# Altium schematic sheet 24V.SchDoc
size A3; SheetNumber: 22; SheetTotal: 29; SPICEModelCacheIVOQGUXW: <root> / <DocumentId>IVOQGUXW</DocumentId> / </root>
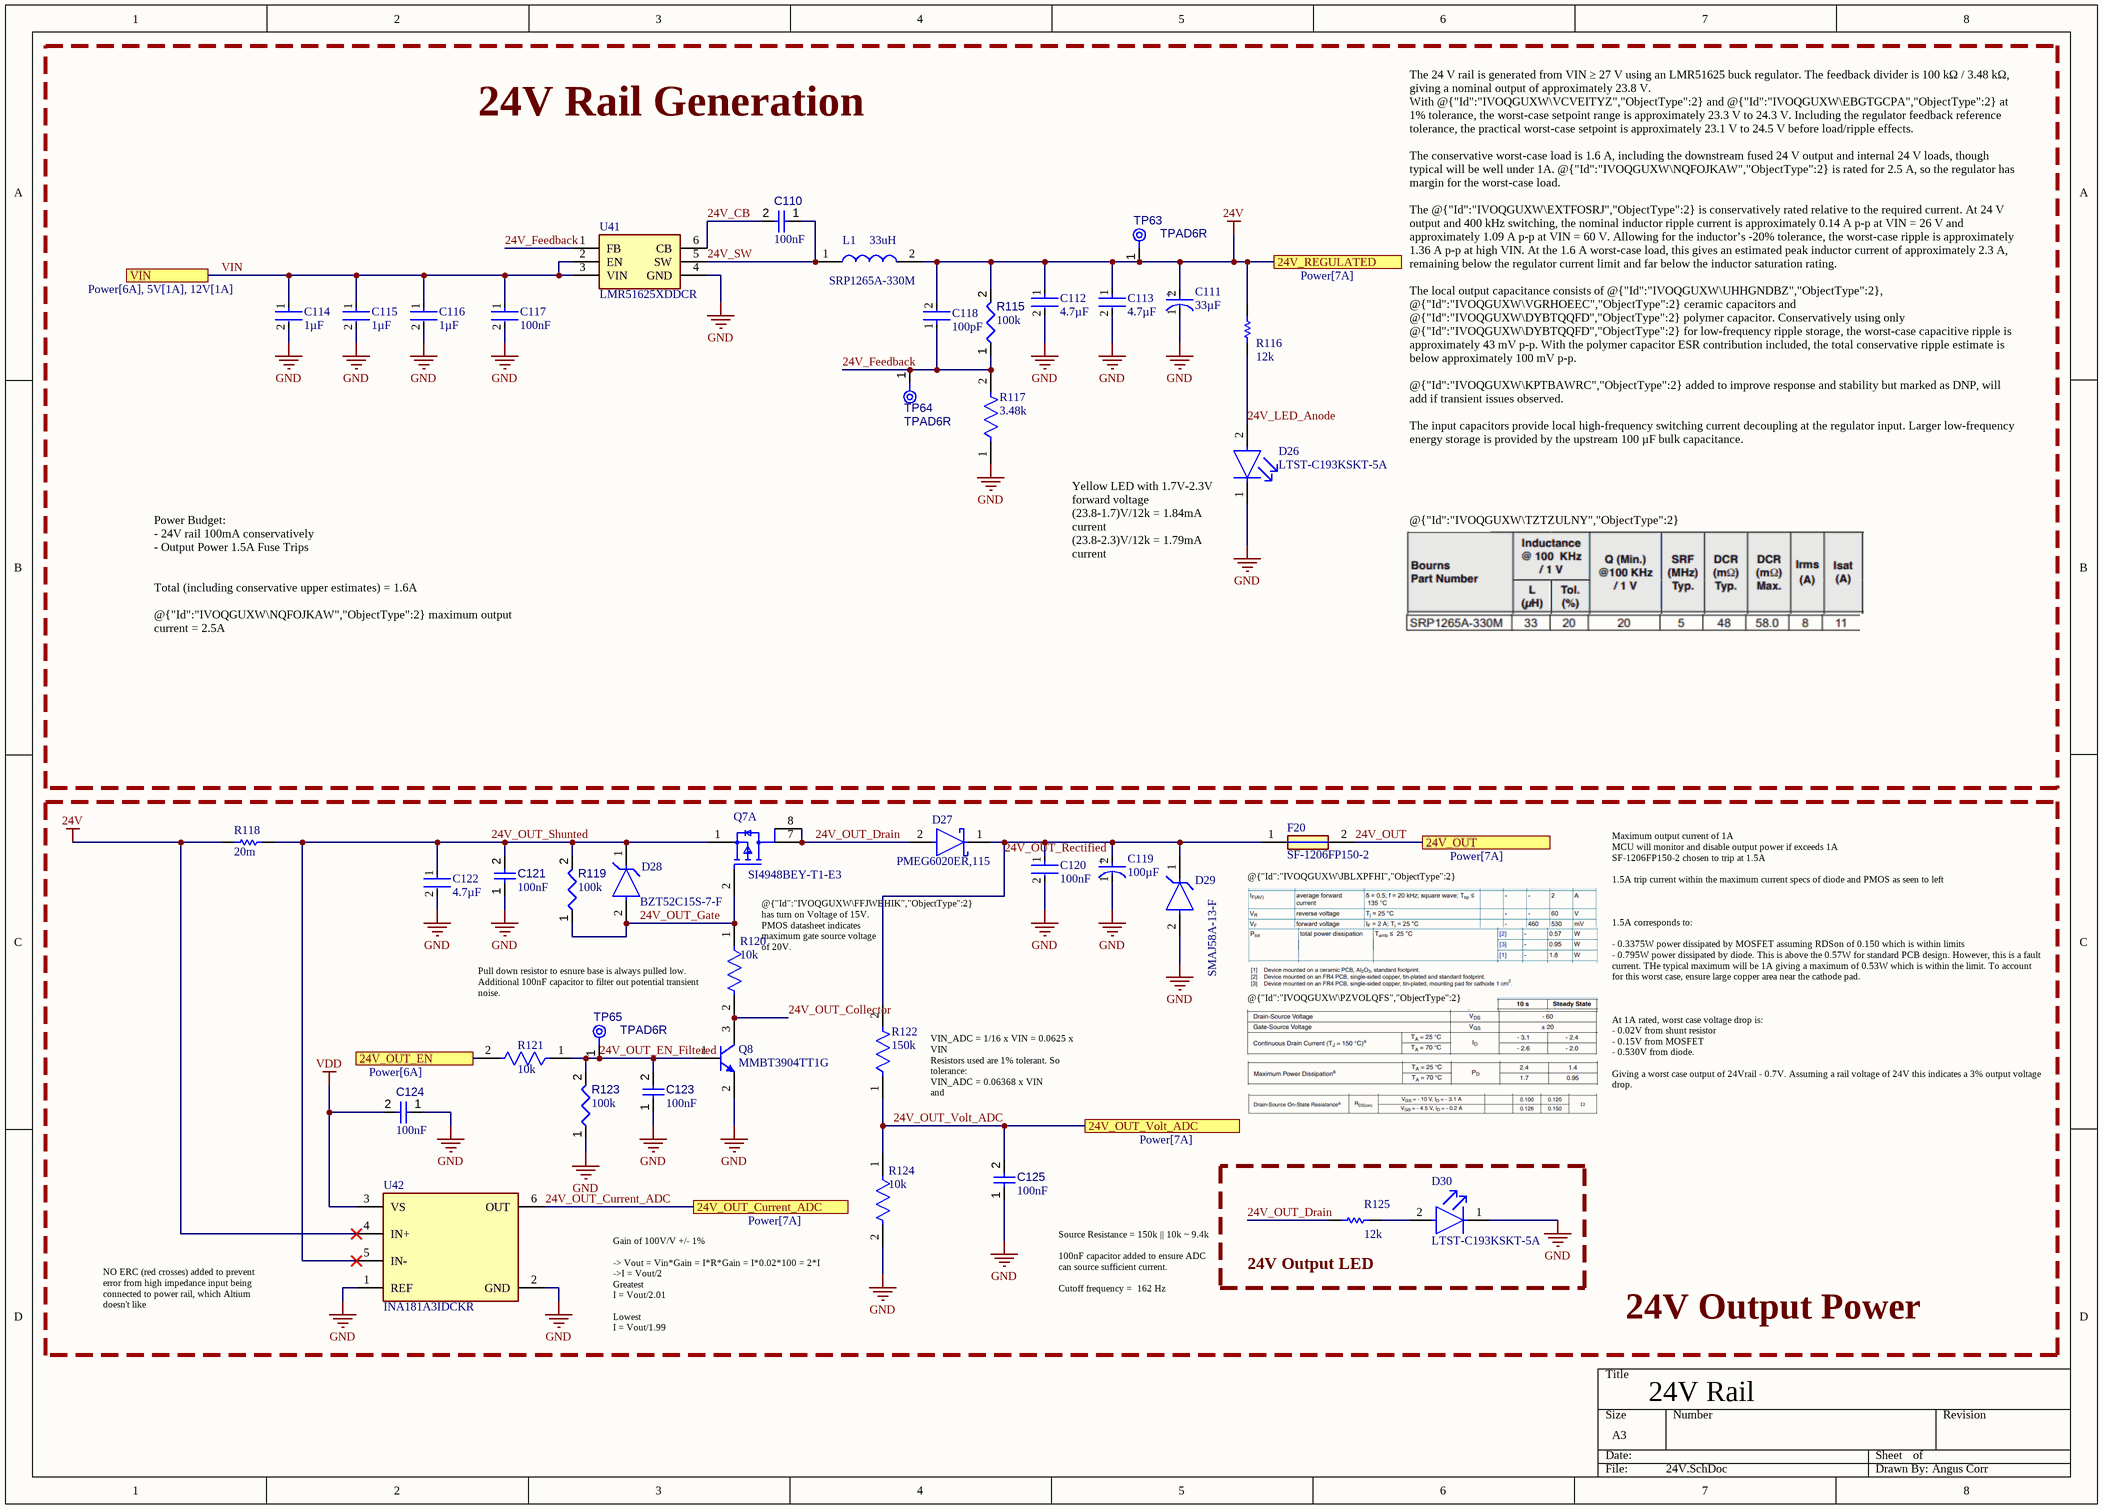
[diagram p0: 24V.SchDoc]

## Parts
C110  value 100nF  [CAPC1608X90X40NL10T20]  (hidden comment: Capacitor 100 nF +/-10% 50 V 0603)
C111  value 33µF  [FP-EEH-D8-MFG]  (hidden comment: EEHZA1H330XP)
C112  value 4.7µF  [FP-GRM21B-0_2-e0_2_0_7-MFG]  (hidden comment: GRM21BZ71H475KE15L)
C113  value 4.7µF  [FP-GRM21B-0_2-e0_2_0_7-MFG]  (hidden comment: GRM21BZ71H475KE15L)
C114  value 1µF  [FP-GRJ21B-0_35-MFG]  (hidden comment: GRJ21BC72A105KE11L)
C115  value 1µF  [FP-GRJ21B-0_35-MFG]  (hidden comment: GRJ21BC72A105KE11L)
C116  value 1µF  [FP-GRJ21B-0_35-MFG]  (hidden comment: GRJ21BC72A105KE11L)
C117  value 100nF  [FP-GRM31C-0_2-e0_3_0_8-IPC_C]  (hidden comment: GRM31C5C2A104JA01L)
C118  value 100pF  [FP-C0603C-CF-IPC_B]  (hidden comment: C0603C101F5GACTU)
C119  value 100µF  [FP-MVYAKE0-MFG]  (hidden comment: EMVY101ARA101MKE0S)
C120  value 100nF  [FP-GRM31C-0_2-e0_3_0_8-IPC_C]  (hidden comment: GRM31C5C2A104JA01L)
C121  value 100nF  [CAPC1608X90X40NL10T20]  (hidden comment: Capacitor 100 nF +/-10% 50 V 0603)
C122  value 4.7µF  [FP-GRM21B-0_2-e0_2_0_7-MFG]  (hidden comment: GRM21BZ71H475KE15L)
C123  value 100nF  [CAPC1608X90X40NL10T20]  (hidden comment: Capacitor 100 nF +/-10% 50 V 0603)
C124  value 100nF  [CAPC1608X90X40NL10T20]  (hidden comment: Capacitor 100 nF +/-10% 50 V 0603)
C125  value 100nF  [CAPC1608X90X40NL10T20]  (hidden comment: Capacitor 100 nF +/-10% 50 V 0603)
D26  LTST-C193KSKT-5A  [FP-LTST-C193KGKT-5A-MFG]
D27  PMEG6020ER,115  [FP-SOD123W-MFG]
D28  BZT52C15S-7-F  [FP-SOD323-IPC_A]
D29  SMAJ58A-13-F  [FP-SMA-MFG]
D30  LTST-C193KSKT-5A  [FP-LTST-C193KGKT-5A-MFG]
F20  SF-1206FP150-2  [FUSC3116X70N]
L1  SRP1265A-330M  [SRP1265A]
Q7  SI4948BEY-T1-E3  [FP-C-06527-IPC_B]  (part A of 2)
Q8  MMBT3904TT1G  [ONSC-SC-75-3-463-01_V]
R115  value 100k  [FP-AC0603-IPC_C]  (hidden comment: AC0603FR-07100KL)
R116  value 12k  [RESC1608X55X25LL10T15]  (hidden comment: RC0603FR-0712KL)
R117  value 3.48k  [FP-AC0603-IPC_C]  (hidden comment: AC0603FR-073K48L)
R118  value 20m  [RESC3216X89X51NL25T25]  (hidden comment: WSL1206R0200FEA)
R119  value 100k  [FP-AC0603-IPC_C]  (hidden comment: AC0603FR-07100KL)
R120  value 10k  [FP-RT0603-IPC_C]  (hidden comment: RT0603BRD0710KL)
R121  value 10k  [FP-RT0603-IPC_C]  (hidden comment: RT0603BRD0710KL)
R122  value 150k  [FP-CRGCQ0603-IPC_A]  (hidden comment: CRGCQ0603F150K)
R123  value 100k  [FP-AC0603-IPC_C]  (hidden comment: AC0603FR-07100KL)
R124  value 10k  [FP-RT0603-IPC_C]  (hidden comment: RT0603BRD0710KL)
R125  value 12k  [RESC1608X55X25LL10T15]  (hidden comment: RC0603FR-0712KL)
TP63  TPAD6R  [TP06R]  (no BOM)
TP64  TPAD6R  [TP06R]  (no BOM)
TP65  TPAD6R  [TP06R]  (no BOM)
U41  LMR51625XDDCR  [SOT95P280X110-6N]
U42  INA181A3IDCKR  [FP-DCK0006A-IPC_A]

## Blocks framed on the sheet
24V Rail Generation: C110-C118 D26 L1 R115-R117 TP63 TP64 U41
24V Output Power: C119-C125 D27-D29 F20 Q7 Q8 R118-R124 TP65 U42
24V Output LED: D30 R125

## Ports
24V_OUT (see Power[7A]), 24V_OUT_Current_ADC (see Power[7A]), 24V_OUT_EN (see Power[6A]), 24V_OUT_Volt_ADC (see Power[7A]), 24V_REGULATED (see Power[7A]), VIN (see Power[6A], 5V[1A], 12V[1A])

## Nets
24V: C111.2(A) C112.1 C113.1 C118.2 L1.2 R115.2 R116.1 R118.1 TP63.1(TP) U42.4(IN+) ; port 24V_REGULATED
GND: C111.1(C) C112.2 C113.2 C114.2 C115.2 C116.2 C117.2 C119.1(C) C120.2 C121.1 C122.2 C123.1 C124.1 C125.1 D26.1(C) D29.2(A) D30.1(C) Q8.2(E) R117.1 R123.1 R124.2 U41.4(GND) U42.1(REF) U42.2(GND)
VDD: C124.2 U42.3(VS)
24V_CB: C110.2 U41.6(CB)
24V_Feedback: C118.1 R115.1 R117.2 TP64.1(TP) U41.1(FB)
24V_LED_Anode: D26.2(A) R116.2
24V_OUT: F20.2 ; port 24V_OUT
24V_OUT_Collector: Q8.3(C) R120.2
24V_OUT_Current_ADC: U42.6(OUT) ; port 24V_OUT_Current_ADC
24V_OUT_Drain: D27.2(A) Q7.7(D1) Q7.8(D1) R125.1
24V_OUT_EN: R121.2 ; port 24V_OUT_EN
24V_OUT_EN_Filtered: C123.2 Q8.1(B) R121.1 R123.2 TP65.1(TP)
24V_OUT_Gate: D28.2(A) Q7.2(G1) R119.1 R120.1
24V_OUT_Rectified: C119.2(A) C120.1 D27.1(C) D29.1(C) F20.1 R122.2
24V_OUT_Shunted: C121.2 C122.1 D28.1(C) Q7.1(S1) R118.2 R119.2 U42.5(IN-)
24V_OUT_Volt_ADC: C125.2 R122.1 R124.1 ; port 24V_OUT_Volt_ADC
24V_SW: C110.1 L1.1 U41.5(SW)
VIN: C114.1 C115.1 C116.1 C117.1 U41.2(EN) U41.3(VIN) ; port VIN
NetD30_2: D30.2(A) R125.2

## Notes on the sheet
- (near L1) 33uH
- The 24 V rail is generated from VIN ≥ 27 V using an LMR51625 buck regulator. The feedback divider is 100 kΩ / 3.48 kΩ, giving a nominal output of approximately 23.8 V.
  With @{"Id":"IVOQGUXW\VCVEITYZ","ObjectType":2} and @{"Id":"IVOQGUXW\EBGTGCPA","ObjectType":2} at 1% tolerance, the worst-case setpoint range is approximately 23.3 V to 24.3 V. Including the regulator feedback reference tolerance, the practical worst-case setpoint is approximately 23.1 V to 24.5 V before load/ripple effects.
  The conservative worst-case load is 1.6 A, including the downstream fused 24 V output and internal 24 V loads, though typical will be well under 1A. @{"Id":"IVOQGUXW\NQFOJKAW","ObjectType":2} is rated for 2.5 A, so the regulator has margin for the worst-case load.
  The @{"Id":"IVOQGUXW\EXTFOSRJ","ObjectType":2} is conservatively rated relative to the required current. At 24 V output and 400 kHz switching, the nominal inductor ripple current is approximately 0.14 A p-p at VIN = 26 V and approximately 1.09 A p-p at VIN = 60 V. Allowing for the inductor’s -20% tolerance, the worst-case ripple is approximately 1.36 A p-p at high VIN. At the 1.6 A worst-case load, this gives an estimated peak inductor current of approximately 2.3 A, remaining below the regulator current limit and far below the inductor saturation rating.
  The local output capacitance consists of @{"Id":"IVOQGUXW\UHHGNDBZ","ObjectType":2}, @{"Id":"IVOQGUXW\VGRHOEEC","ObjectType":2} ceramic capacitors and @{"Id":"IVOQGUXW\DYBTQQFD","ObjectType":2} polymer capacitor. Conservatively using only @{"Id":"IVOQGUXW\DYBTQQFD","ObjectType":2} for low-frequency ripple storage, the worst-case capacitive ripple is approximately 43 mV p-p. With the polymer capacitor ESR contribution included, the total conservative ripple estimate is below approximately 100 mV p-p.
  @{"Id":"IVOQGUXW\KPTBAWRC","ObjectType":2} added to improve response and stability but marked as DNP, will add if transient issues observed.
  The input capacitors provide local high-frequency switching current decoupling at the regulator input. Larger low-frequency energy storage is provided by the upstream 100 µF bulk capacitance.
  VIN should remain above approximately 27 V under load.
- (near D26) Yellow LED with 1.7V-2.3V forward voltage
  (23.8-1.7)V/12k = 1.84mA current
  (23.8-2.3)V/12k = 1.79mA current
- @{"Id":"IVOQGUXW\TZTZULNY","ObjectType":2} stats
- Power Budget:
  - 24V rail 100mA conservatively
  - Output Power 1.5A Fuse Trips
  Total (including conservative upper estimates) = 1.6A
  @{"Id":"IVOQGUXW\NQFOJKAW","ObjectType":2} maximum output current = 2.5A
- (near F20) @{"Id":"IVOQGUXW\JBLXPFHI","ObjectType":2} specs
- @{"Id":"IVOQGUXW\FFJWBHIK","ObjectType":2} has turn on Voltage of 15V. PMOS datasheet indicates maximum gate source voltage of 20V.
- (near R120) Pull down resistor to esnure base is always pulled low. Additional 100nF capacitor to filter out potential transient noise.
- @{"Id":"IVOQGUXW\PZVOLQFS","ObjectType":2} specs
- VIN_ADC = 1/16 x VIN = 0.0625 x VIN
  Resistors used are 1% tolerant. So tolerance:
  VIN_ADC = 0.06368 x VIN
  and
  VIN_ADC = 0.06238 x VIN
- Maximum output current of 1A
  MCU will monitor and disable output power if exceeds 1A
  SF-1206FP150-2 chosen to trip at 1.5A
  1.5A trip current within the maximum current specs of diode and PMOS as seen to left
  1.5A corresponds to:
  - 0.3375W power dissipated by MOSFET assuming RDSon of 0.150 which is within limits
  - 0.795W power dissipated by diode. This is above the 0.57W for standard PCB design. However, this is a fault current. THe typical maximum will be 1A giving a maximum of 0.53W which is within the limit. To account for this worst case, ensure large copper area near the cathode pad.
  At 1A rated, worst case voltage drop is:
  - 0.02V from shunt resistor
  - 0.15V from MOSFET
  - 0.530V from diode.
  Giving a worst case output of 24Vrail - 0.7V. Assuming a rail voltage of 24V this indicates a 3% output voltage drop.
- NO ERC (red crosses) added to prevent error from high impedance input being connected to power rail, which Altium doesn't like
- Source Resistance = 150k || 10k ~ 9.4k
  100nF capacitor added to ensure ADC can source sufficient current.
  Cutoff frequency =  162 Hz
- (near R124) Gain of 100V/V +/- 1%
  -> Vout = Vin*Gain = I*R*Gain = I*0.02*100 = 2*I
  ->I = Vout/2
  Greatest
  I = Vout/2.01
  Lowest
  I = Vout/1.99
- 24V Rail
- Angus Corr
- (in symbol CMP-001-00104-1) +
- (in symbol CMP-001-00147-1) +

## Library data of the parts
C110 C121 C123-C125 = CMP-001-00017-6: Chip Capacitor, 100 nF, +/- 10%, 50 V, 0603 (1608 Metric); Voltage Rating: 50V; Capacitor Type: Ceramic; Tolerance: 10%; Mounting Technology: SM; Max Operating Temperature: 125°C; RoHS Compliant: True; Pins: 2; Case/Package: 0603; Min Operating Temperature: -55°C
C111 = CMP-001-00147-1: Cap Aluminum 33uF 50V 20% (6.3 X 7.7mm) SMD 0.04 Ohm 1600mA 5000 hr 105°C Embossed T/R; Ripple Current (AC): 1.6A; Max Operating Temperature: 105°C; Voltage Rating: 50V; Mounting Technology: Surface Mount; Pins: 8; Ripple Current: 1.6A; Tolerance: 20%; Min Operating Temperature: -55°C; Case/Package: Radial
C112 C113 C122 = CMP-001-00149-1: 50V 4.7uF X7R ±10% 0805 Multilayer Ceramic Capacitors MLCC - SMD/SMT ROHS; Manufacturer Lifecycle Status: IN PRODUCTION; Case/Package: 0805; Tolerance: 10%; Voltage Rating: 50V; Min Operating Temperature: -55°C; Mounting Technology: Surface Mount; Max Operating Temperature: 125°C; Country of Origin: Japan, Mainland China, Philippines, Singapore, Thailand; Dielectric Material: Ceramic; Export Control Classification Number (ECCN) Code: EAR99; Harmonized Tariff Schedule (HTS) Code: 8532.24.00.20; Height: 1.25mm; Introduction Date: 2017-02-22; Length: 2mm; Lifecycle Status: Production; Material: Ceramic; Number of Terminals: 2; REACH SVHC: Yes; RoHS: Compliant; Thickness: 1.25mm; Voltage Rating (DC): 50V; Width: 1.25mm
C114-C116 = CMP-001-00143-2: 100V 1uF X7S ±10% 0805 Multilayer Ceramic Capacitors MLCC - SMD/SMT ROHS; Manufacturer Lifecycle Status: IN PRODUCTION; Mounting Technology: Surface Mount; Voltage Rating: 100V; Max Operating Temperature: 125°C; Min Operating Temperature: -55°C; Tolerance: 10%; Case/Package: 0805; Case Code (Imperial): 0805; Case Code (Metric): 2012; Dielectric Material: Ceramic; Dielectric: X7S; Export Control Classification Number (ECCN) Code: EAR99; Features: Soft Termination; Harmonized Tariff Schedule (HTS) Code: 8532.24.00.20; Height: 1.25mm; Introduction Date: 2015-11-10; Length: 2mm; Lifecycle Status: Production; Material: Ceramic; Number of Terminals: 2; Packaging: Cut Tape; REACH SVHC: Yes; RoHS: Compliant; Schedule B: 8532240020, 8532240020; Thickness: 1.25mm; Voltage Rating (DC): 100V; Width: 1.25mm
C117 C120 = CMP-001-00103-1: 100V 100nF C0G ±5% 1206 Multilayer Ceramic Capacitors MLCC - SMD/SMT ROHS; Min Operating Temperature: -55°C; Mounting Technology: Surface Mount; Case/Package: 1206; Max Operating Temperature: 125°C; Tolerance: 5%; Voltage Rating: 100V
C118 = CMP-001-00144-1: 50V 100pF C0G ±1% 0603 Multilayer Ceramic Capacitors MLCC - SMD/SMT ROHS; Temperature Coefficient: 30ppm/°C; Dissipation Factor: 0.1%; China RoHS: Compliant; Max Operating Temperature: 125°C; Lifecycle Status: Production; RoHS: Compliant; Mounting Technology: Surface Mount; Termination: SMD/SMT; Length: 1.6mm; Thickness: 863.6µm; Lead Pitch: 700µm; REACH SVHC: Yes; Harmonized Tariff Schedule (HTS) Code: 8532.24.00.20; Country of Origin: Mexico; Height: 800µm; Lead Free: Lead Free; Export Control Classification Number (ECCN) Code: EAR99; Voltage Rating (DC): 50V; Introduction Date: 2008-06-06; Schedule B: 8532240020, 8532240020; Width: 800µm; Material: Ceramic; Case Code (Imperial): 0603; Min Operating Temperature: -55°C; Dielectric Material: Ceramic; Depth: 800µm; Voltage Rating: 50V; Tolerance: 1%; Case Code (Metric): 1608; Packaging: Cut Tape; Dielectric: C0G; Case/Package: 0603; Number of Terminals: 2
C119 = CMP-001-00104-1: Cap Aluminum 100uF 100V 20% (12.5 X 13.5mm) SMD 450mA 5000h 105°C T/R; Mounting Technology: Surface Mount; Ripple Current: 450mA; Tolerance: 20%; Case/Package: SMD/SMT; Pins: 2; Max Operating Temperature: 105°C; Min Operating Temperature: -40°C; Voltage Rating: 100V; Ripple Current (AC): 450mA
D26 D30 = CMP-007-00044-1: LED yellow 0603 wavelength 587~594.5nm light intensity 7.1~45mcd Front Mounting; Shape: Rectangular; Power Dissipation: 50mW; Peak Wavelength: 591nm; Number of Circuits: 1; Lens Style: Colorless, Diffused, Rectangular; Test Current: 5mA; Forward Voltage: 2.3V; Lens Transparency: Clear; Lens Color: Clear, Colorless; Viewing Angle: 130°; Forward Current: 30mA; Reverse Voltage: 5V; Luminous Intensity: 26.05mcd; Schedule B: 8541402000, 8541402000; Introduction Date: 2007-04-09; Min Operating Temperature: -55°C; RoHS: Compliant; Terminal Pitch: 1.5mm; Case/Package: 0603; Width: 800µm; Dominant Wavelength: 594.5nm; Pins: 2; Case Code (Imperial): 0603; Height: 350µm; Length: 1.6mm; Color: Yellow; Lead Free: Lead Free; Max Operating Temperature: 85°C; Wavelength: 594.5nm; Harmonized Tariff Schedule (HTS) Code: 8541.40.20.00; China RoHS: Compliant; Illumination Color: Yellow; Number of Terminals: 2; Radiation Hardening: No; Case Code (Metric): 1608; Number of LEDs: 1; Depth: 800µm; Lifecycle Status: Production; REACH SVHC: Yes; Mounting Technology: Surface Mount; Number of Elements: 1
D27 = CMP-004-00064-1: PMEG6020 Series 60 V 2 A SMT Llow VF MEGA Schottky Barrier Rectifier - SOD-123W; Forward Current: 2A; Forward Voltage: 530mV; Min Operating Temperature: -55°C; Max Operating Temperature: 150°C; Pins: 2
D28 = CMP-004-00045-1: BZT52C15S Series 200 mW 15 V 10 mA Surface Mount Zener Diode - SOD-323; Forward Voltage: 900mV; Forward Current: 10mA; Pins: 2; Max Operating Temperature: 150°C; Mounting Technology: Surface Mount; Min Operating Temperature: -65°C
D29 = CMP-004-00082-1: SMAJ Series 58 V 400 W SMT Uni-Directional TVS Diode - DO-214AC; Forward Voltage: 3.5V; Max Surge Current: 40A; Case/Package: SMA; Max Operating Temperature: 150°C; Min Operating Temperature: -55°C; Mounting Technology: Surface Mount; Pins: 2
F20 = CMP-005-00025-1: Surface Mount Fuses 1.5A Fast Acting 1206 Singlfuse; Manufacturer_Name: Bourns; Mouser Part Number: 652-SF-1206FP150-2; Mouser Price/Stock: https://www.mouser.co.uk/ProductDetail/Bourns/SF-1206FP150-2?qs=YCa%2FAAYMW02QT85STQYHfQ%3D%3D; Manufacturer_Part_Number: SF-1206FP150-2; Datasheet Link: https://www.arrow.com/en/products/sf-1206fp150-2/bourns; Source: MAX17643ATC+.SchLib; Arrow Part Number: SF-1206FP150-2; Design Item ID: SF-1206FP150-2; Height: 0.7mm; Arrow Price/Stock: https://www.arrow.com/en/products/sf-1206fp150-2/bourns?utm_currency=USD&region=nac
L1 = CMP-006-00028-1: Bourns SRP1265A Series Shielded Wire-wound SMD Inductor with a Carbonyl Powder Core; Datasheet Link: http://www.bourns.com/docs/Product-Datasheets/SRP1265A.pdf; Design Item ID: SRP1265A-330M; Manufacturer_Name: Bourns; Manufacturer_Part_Number: SRP1265A-330M; Mouser Price/Stock: https://www.mouser.co.uk/ProductDetail/Bourns/SRP1265A-330M?qs=7z%252BmIopC6%2FLdNy531NHhxQ%3D%3D; Arrow Part Number: SRP1265A-330M; Mouser Part Number: 652-SRP1265A-330M; Arrow Price/Stock: https://www.arrow.com/en/products/srp1265a-330m/bourns?utm_currency=USD&region=nac; Source: MAX17643ATC+.SchLib
Q7 = CMP-013-00038-1: Dual P-Channel 60 V 0.12 Ohms Surface Mount Power Mosfet - SOIC-8; Nominal Vgs: -3V; Max Operating Temperature: 175°C; Mounting Technology: Surface Mount; Min Operating Temperature: -55°C; Case/Package: SO; Pins: 8
Q8 = CMP-013-00039-1: on Semi MMBT3904TT1G NPN Bipolar Transistor, 0.2 A, 40 V, 3-PIN SOT-416; Frequency: 300MHz; Min Operating Temperature: -55°C; Max Operating Temperature: 150°C; Case/Package: SOT-416; Pins: 3
R115 R119 R123 = CMP-009-00345-3: Res Thick Film 0603 100K Ohm 1% 0.1W(1/10W) ±100ppm/C Pad SMD T/R Automotive; Voltage Rating: 75V; Max Power Dissipation: 100mW; Temperature Coefficient: 100ppm/°C; Max Operating Temperature: 155°C; Tolerance: 1%; Case/Package: 0603; Mounting Technology: Surface Mount; Min Operating Temperature: -55°C; Case Code (Imperial): 0603; Case Code (Metric): 1608; China RoHS: Non-Compliant; Composition: Thick Film; Country of Origin: Mainland China, Taiwan; Depth: 800µm; Export Control Classification Number (ECCN) Code: EAR99; Features: Anti-Sulfur, Automotive AEC-Q200, Moisture Resistant; Harmonized Tariff Schedule (HTS) Code: 8533.21.00.30; Height: 450µm; Introduction Date: 2012-04-10; Lead Free: Lead Free; Length: 1.6mm; Lifecycle Status: Production; Military Standard: Not; Number of Terminals: 2; Number of Terminations: 2; Packaging: Tape & Reel; Power Rating: 100mW; Ratings: AEC-Q200; REACH SVHC: Yes; RoHS: Compliant; Schedule B: 8533210045, 8533210045; Termination: SMD/SMT; Width: 800µm; Working Voltage: 75V
R116 R125 = CMP-009-00357-1: 100mW Thick Film Resistors 75V ±100ppm/℃ ±1% 12kΩ 0603 Chip Resistor - Surface Mount ROHS; Voltage Rating: 50V; Temperature Coefficient: 100ppm/°C; Voltage Rating (DC): 50V; Tolerance: 1%; Composition: Thick Film; Length: 1.6mm; Min Operating Temperature: -55°C; Schedule B: 8533210045, 8533210045; Power Rating: 100mW; Max Operating Temperature: 155°C; Height: 450µm; China RoHS: Non-Compliant; Packaging: Tape and Reel; Width: 800µm; Pins: 2; REACH SVHC: Yes; Case/Package: 0603; RoHS: Compliant; Lifecycle Status: Production; Number of Terminals: 2; Mounting Technology: Surface Mount; Working Voltage: 75V; Case Code (Imperial): 0603; Case Code (Metric): 1608; Depth: 800µm; Features: Moisture Resistant; Lead Free: Lead Free; Max Power Dissipation: 100mW; Military Standard: Not; Number of Terminations: 2; Termination: SMD/SMT
R117 = CMP-009-00282-1: Res Thick Film 0603 3.48K Ohm 1% 0.1W(1/10W) ±100ppm/C Pad SMD T/R Automotive AEC-Q200; Voltage Rating: 75V; Max Operating Temperature: 155°C; Mounting Technology: Surface Mount; Min Operating Temperature: -55°C; Tolerance: 1%; Case/Package: 0603
R118 = CMP-009-00308-1: Res Metal Strip 1206 0.02 Ohm 1% 1/4W ±75ppm/°C Molded SMD SMD Embossed Plastic T/R; Voltage Rating: 70mV; Pins: 2; Min Operating Temperature: -65°C; Tolerance: 1%; Mounting Technology: Surface Mount; Max Operating Temperature: 170°C; Case/Package: 1206
R120 R121 R124 = CMP-009-00322-1: Res Thin Film 0603 10K Ohm 0.1% 1/10W |25ppm/|C SMD Paper T/R; Voltage Rating: 75V; Max Power Dissipation: 100mW; Temperature Coefficient: 25ppm/°C; Min Operating Temperature: -55°C; Case/Package: 0603; Mounting Technology: Surface Mount; Max Operating Temperature: 155°C; Tolerance: 0.1%; Case Code (Imperial): 0603; China RoHS: Non-Compliant; Composition: Thin Film; Country of Origin: Mainland China, Taiwan; Depth: 800µm; Export Control Classification Number (ECCN) Code: EAR99; Features: Moisture Resistant; Harmonized Tariff Schedule (HTS) Code: 8533.21.00.30; Height: 450µm; Introduction Date: 2008-06-09; Lead Free: Lead Free; Length: 1.6mm; Lifecycle Status: Production; Military Standard: Not; Number of Terminals: 2; Number of Terminations: 2; Power Rating: 100mW; REACH SVHC: Yes; RoHS: Compliant; Schedule B: 8533210045, 8533210045; Termination: SMD/SMT; Voltage Rating (DC): 75V; Weight: 2.012816mg; Width: 800µm; Working Voltage: 75V
R122 = CMP-009-00207-1: Res Thick Film 0603 150K Ohm 1% 0.1W(1/10W) ±100ppm/C Pad SMD Automotive T/R; Voltage Rating: 75V; Mounting Technology: Surface Mount; Case/Package: 0603; Min Operating Temperature: -55°C; Max Operating Temperature: 155°C; Tolerance: 1%
TP63-TP65 = CMP-00028-00002-2: 0.6mm round; Pins: 1
U41 = CMP-031-00022-1: Switching Voltage Regulators SIMPLE SWITCHER synchronous buck converter with 4.3V-to-60V; Manufacturer_Name: Texas Instruments; Source: MAX17643ATC+.SchLib; Mouser Part Number: 595-LMR51625XDDCR; Manufacturer_Part_Number: LMR51625XDDCR; Arrow Price/Stock: https://www.arrow.com/en/products/lmr51625xddcr/texas-instruments.html?utm_currency=USD&region=nac; Mouser Price/Stock: https://www.mouser.co.uk/ProductDetail/Texas-Instruments/LMR51625XDDCR?qs=efUn273yAheKjJQ13bmSQQ%3D%3D; Height: 1.1mm; Datasheet Link: https://www.ti.com/lit/ds/symlink/lmr51625.pdf?ts=1740555768028; Arrow Part Number: LMR51625XDDCR; Design Item ID: LMR51625XDDCR
U42 = CMP-014-00006-1: 26-V bi-directional 350-kHz current-sense amplifier 6-SC70 -40 to 125; Max Supply Voltage: 5.5V; Min Supply Voltage: 2.7V; Min Operating Temperature: -40°C; Pins: 6; Max Operating Temperature: 125°C